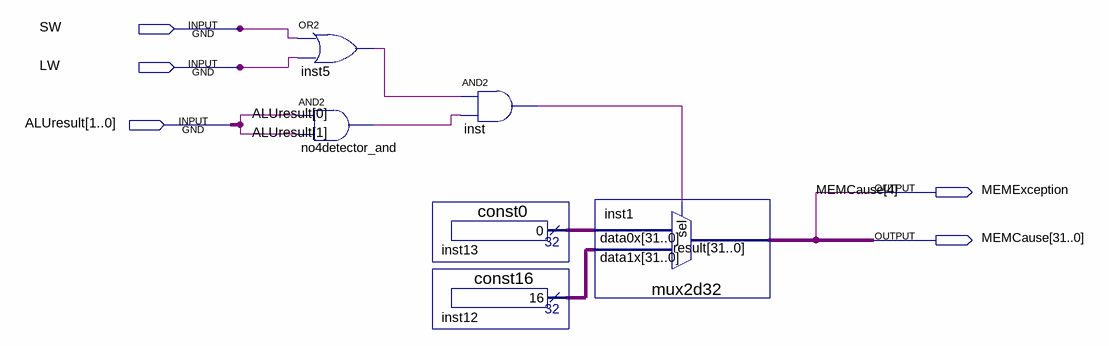
[diagram p0: schematic sheet]
// Quartus schematic Not4Detector.bdf as structural Verilog: 6 symbols, 5 pins
module Not4Detector (
  input  SW,
  input  LW,
  input  [1:0] ALUresult,
  output MEMException,
  output [31:0] MEMCause
);

  wire inst5_out, inst_out, no4detector_and_out;
  wire [31:0] inst12_result, inst13_result;

  or inst5 (inst5_out, SW, LW);
  and no4detector_and (no4detector_and_out, ALUresult[0], ALUresult[1]);
  const0 inst13 (.result(inst13_result));
  const16 inst12 (.result(inst12_result));
  and inst (inst_out, inst5_out, no4detector_and_out);
  mux2d32 inst1 (.data1x(inst12_result), .data0x(inst13_result), .sel(inst_out), .result(MEMCause));

  assign MEMException = MEMCause[4];
endmodule
